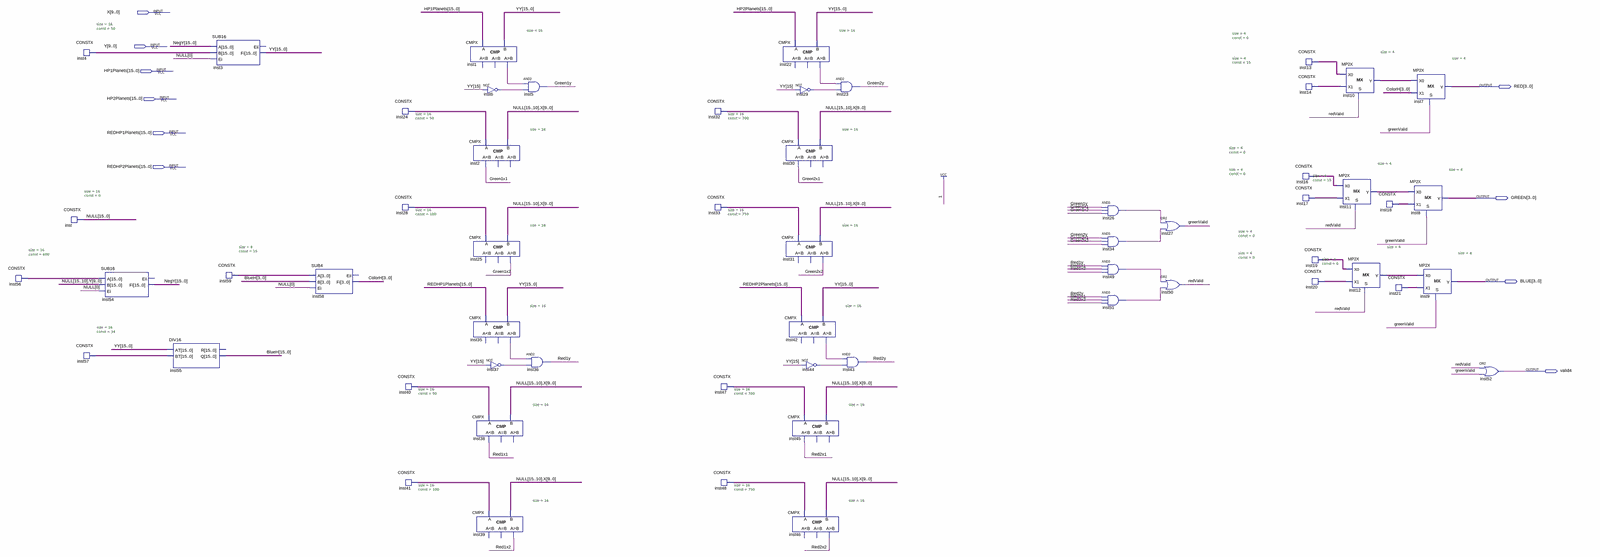
[diagram p0: schematic sheet, whole]
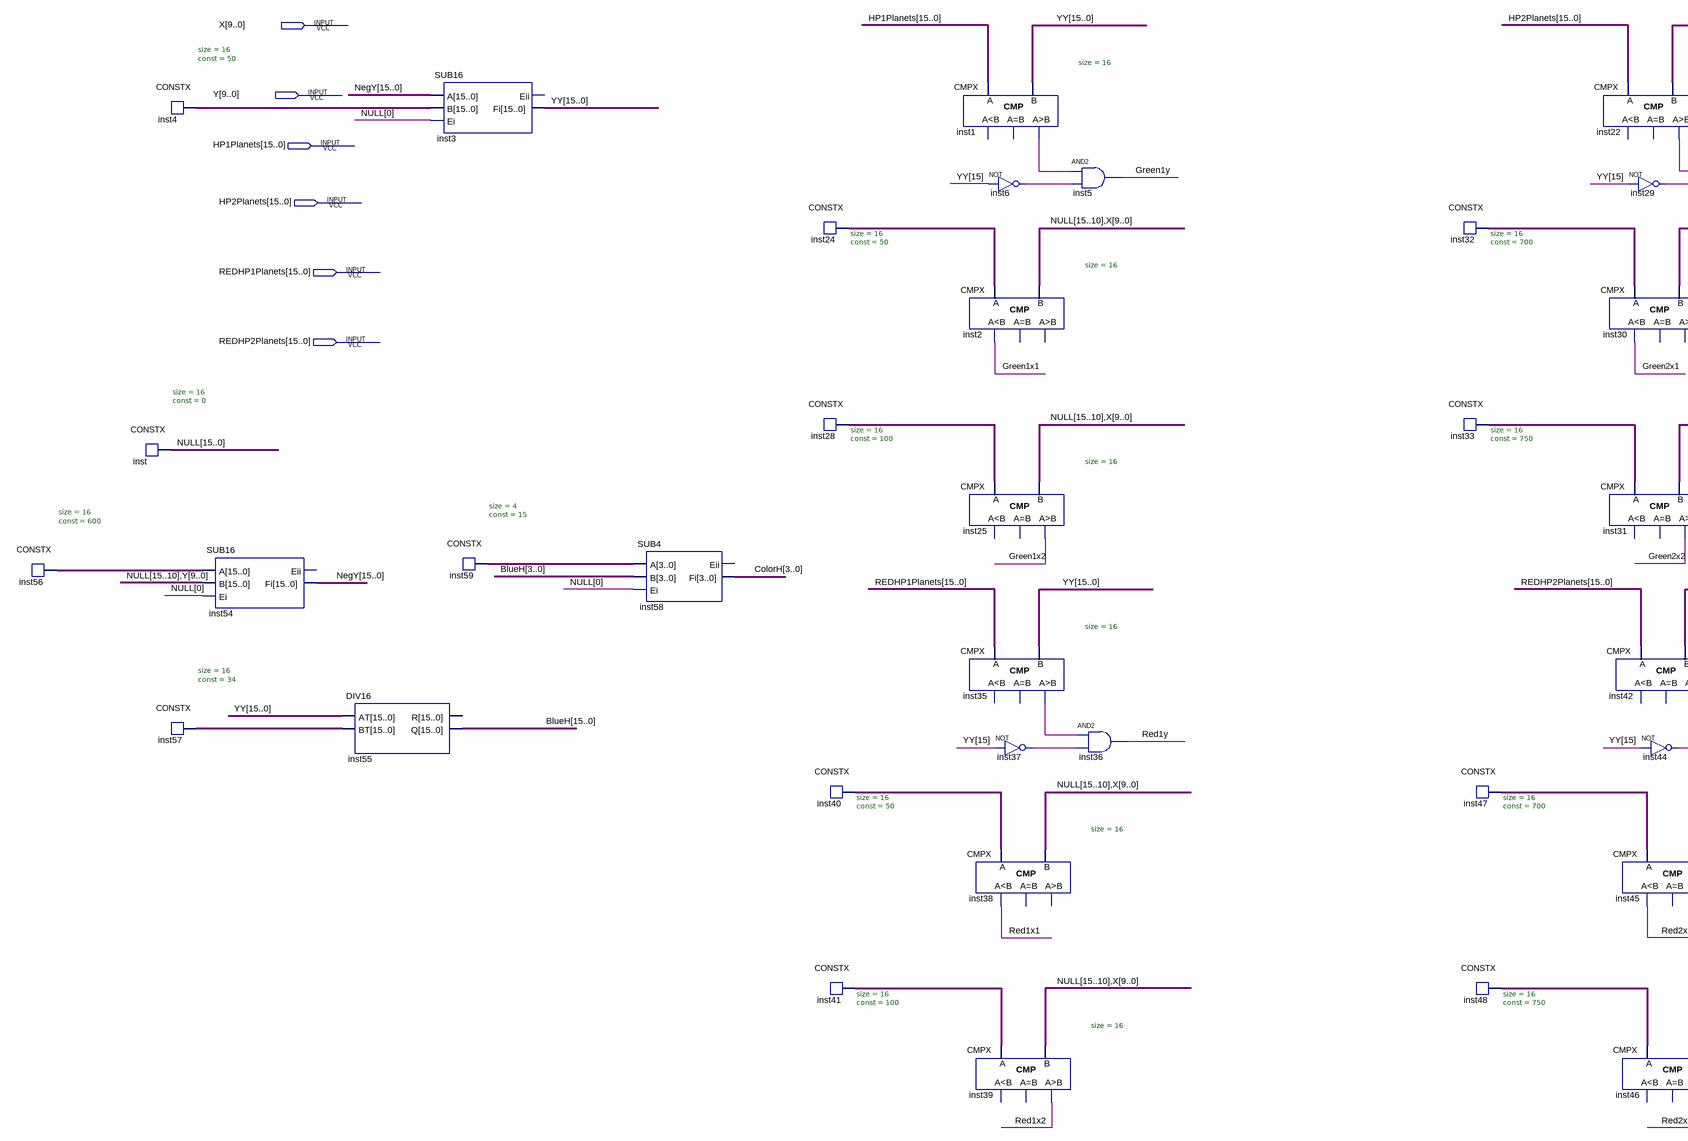
[diagram p1: schematic sheet, left part]
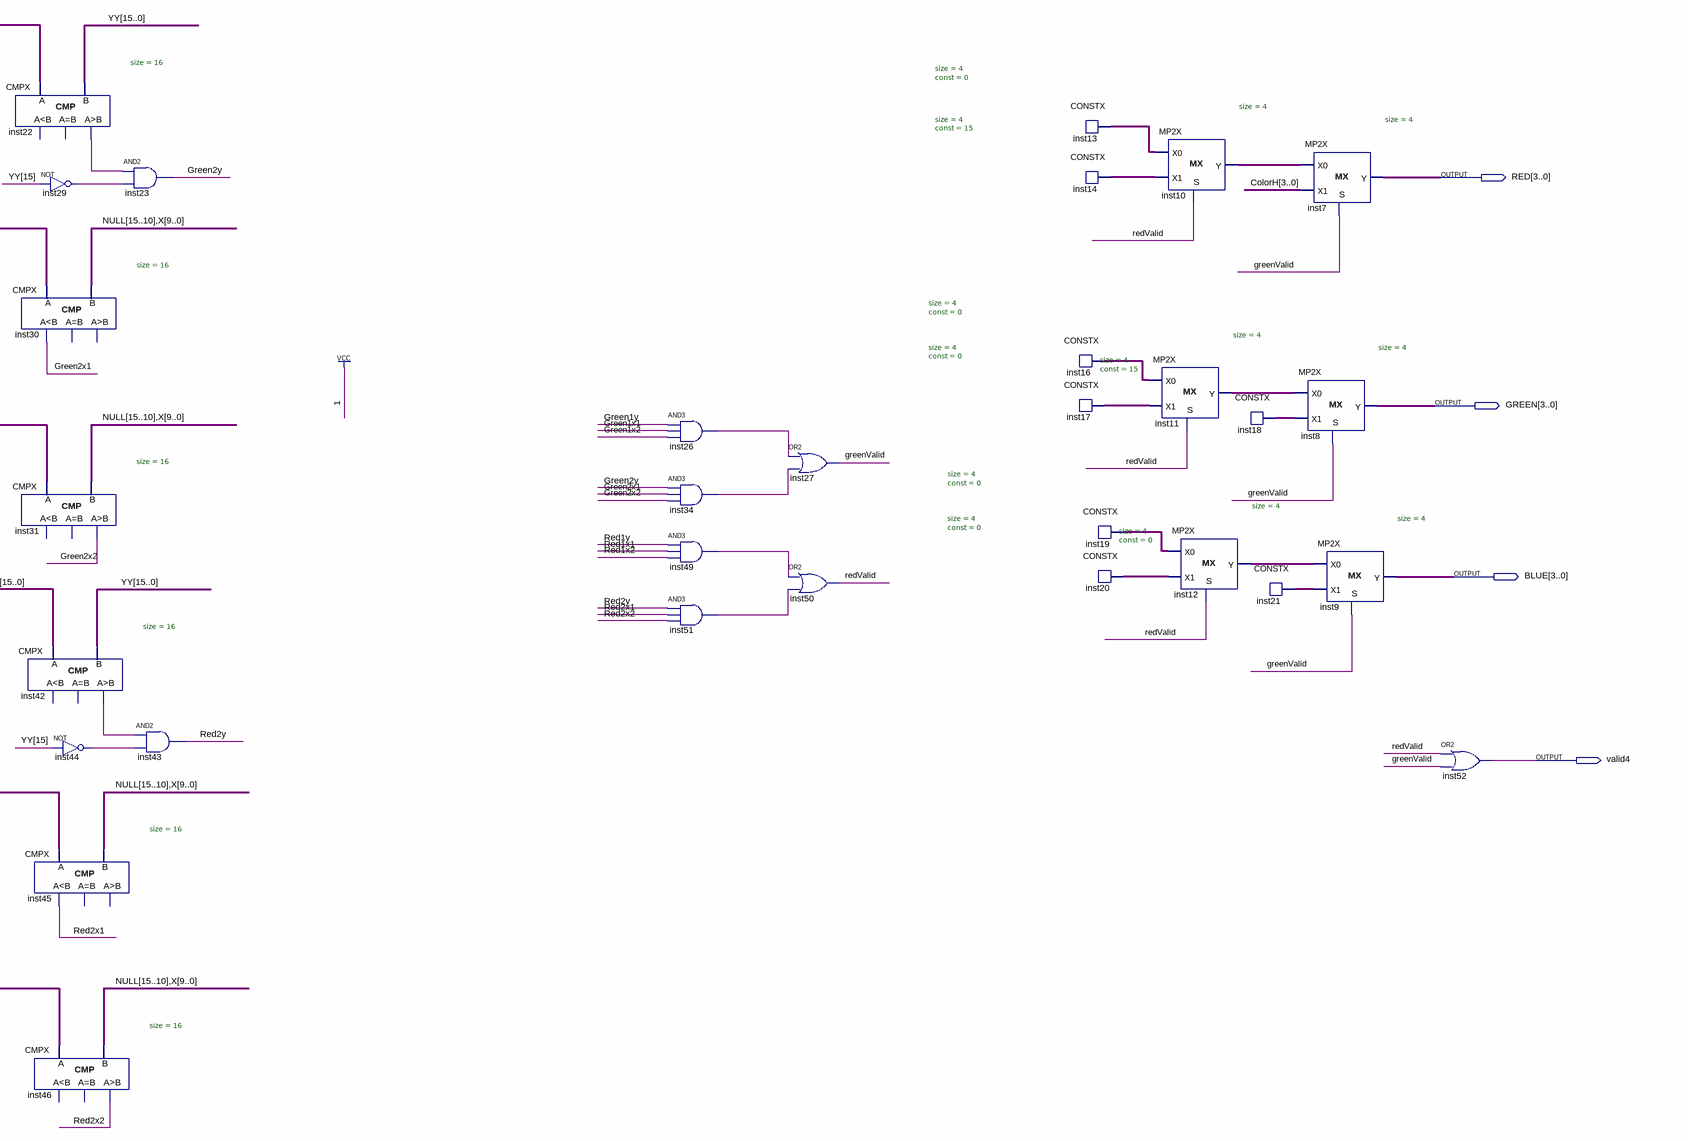
[diagram p2: schematic sheet, right part]
// Quartus schematic heltsDraw.bdf as structural Verilog: 58 symbols, 10 pins
module heltsDraw (
  input  [9:0] X,
  input  [9:0] Y,
  input  [15:0] HP1Planets,
  input  [15:0] HP2Planets,
  input  [15:0] REDHP1Planets,
  input  [15:0] REDHP2Planets,
  output [3:0] RED,
  output [3:0] GREEN,
  output [3:0] BLUE,
  output valid4
);

  wire Green1x1, Green1x2, Green1y, Green2x1, Green2x2, Green2y, greenValid, inst1_gr, inst6_out, inst22_gr,
       inst26_out, inst29_out, inst34_out, inst35_gr, inst37_out, inst42_gr, inst44_out, inst49_out,
       inst51_out, Red1x1, Red1x2, Red1y, Red2x1, Red2x2, Red2y, redValid;
  wire [3:0] ColorH, inst10_y, inst11_y, inst12_y, inst13_data, inst14_data, inst16_data, inst17_data,
       inst18_data, inst19_data, inst20_data, inst21_data, inst59_data;
  wire [15:0] BlueH, inst4_data, inst24_data, inst28_data, inst32_data, inst33_data, inst40_data,
       inst41_data, inst47_data, inst48_data, inst56_data, inst57_data, NegY, NULL, YY;

  CONSTX #(.size(16), .\const (600)) inst56 (.data(inst56_data));
  CONSTX #(.size(16), .\const (50)) inst4 (.data(inst4_data));
  CONSTX #(.size(16), .\const (0)) inst (.data(NULL));
  CONSTX #(.size(16), .\const (34)) inst57 (.data(inst57_data));
  SUB16 inst54 (.A(inst56_data), .B({NULL[15:10], Y}), .Ei(NULL[0]), .Fi(NegY));  // open: Eii
  DIV16 inst55 (.AT(YY), .BT(inst57_data), .Q(BlueH));  // open: R
  SUB16 inst3 (.A(NegY), .B(inst4_data), .Ei(NULL[0]), .Fi(YY));  // open: Eii
  CONSTX #(.size(4), .\const (15)) inst59 (.data(inst59_data));
  SUB4 inst58 (.A(inst59_data), .B(BlueH[3:0]), .Ei(NULL[0]), .Fi(ColorH));  // open: Eii
  CONSTX #(.size(16), .\const (50)) inst24 (.data(inst24_data));
  CONSTX #(.size(16), .\const (100)) inst28 (.data(inst28_data));
  CONSTX #(.size(16), .\const (50)) inst40 (.data(inst40_data));
  CONSTX #(.size(16), .\const (100)) inst41 (.data(inst41_data));
  CMPX #(.size(16)) inst1 (.A(HP1Planets), .B(YY), .gr(inst1_gr));  // open: ls, eq
  CMPX #(.size(16)) inst2 (.A(inst24_data), .B({NULL[15:10], X}), .ls(Green1x1));  // open: eq, gr
  CMPX #(.size(16)) inst25 (.A(inst28_data), .B({NULL[15:10], X}), .gr(Green1x2));  // open: ls, eq
  CMPX #(.size(16)) inst35 (.A(REDHP1Planets), .B(YY), .gr(inst35_gr));  // open: ls, eq
  CMPX #(.size(16)) inst38 (.A(inst40_data), .B({NULL[15:10], X}), .ls(Red1x1));  // open: eq, gr
  CMPX #(.size(16)) inst39 (.A(inst41_data), .B({NULL[15:10], X}), .gr(Red1x2));  // open: ls, eq
  not inst6 (inst6_out, YY[15]);
  not inst37 (inst37_out, YY[15]);
  and inst5 (Green1y, inst1_gr, inst6_out);
  and inst36 (Red1y, inst35_gr, inst37_out);
  CONSTX #(.size(16), .\const (700)) inst32 (.data(inst32_data));
  CONSTX #(.size(16), .\const (750)) inst33 (.data(inst33_data));
  CONSTX #(.size(16), .\const (700)) inst47 (.data(inst47_data));
  CONSTX #(.size(16), .\const (750)) inst48 (.data(inst48_data));
  CMPX #(.size(16)) inst22 (.A(HP2Planets), .B(YY), .gr(inst22_gr));  // open: ls, eq
  not inst29 (inst29_out, YY[15]);
  CMPX #(.size(16)) inst30 (.A(inst32_data), .B({NULL[15:10], X}), .ls(Green2x1));  // open: eq, gr
  CMPX #(.size(16)) inst31 (.A(inst33_data), .B({NULL[15:10], X}), .gr(Green2x2));  // open: ls, eq
  CMPX #(.size(16)) inst42 (.A(REDHP2Planets), .B(YY), .gr(inst42_gr));  // open: ls, eq
  not inst44 (inst44_out, YY[15]);
  CMPX #(.size(16)) inst45 (.A(inst47_data), .B({NULL[15:10], X}), .ls(Red2x1));  // open: eq, gr
  CMPX #(.size(16)) inst46 (.A(inst48_data), .B({NULL[15:10], X}), .gr(Red2x2));  // open: ls, eq
  and inst23 (Green2y, inst22_gr, inst29_out);
  and inst43 (Red2y, inst42_gr, inst44_out);
  and inst26 (inst26_out, Green1y, Green1x1, Green1x2);
  and inst34 (inst34_out, Green2y, Green2x1, Green2x2);
  and inst49 (inst49_out, Red1y, Red1x1, Red1x2);
  and inst51 (inst51_out, Red2y, Red2x1, Red2x2);
  or inst27 (greenValid, inst26_out, inst34_out);
  or inst50 (redValid, inst49_out, inst51_out);
  CONSTX #(.size(4), .\const (0)) inst13 (.data(inst13_data));
  CONSTX #(.size(4), .\const (15)) inst14 (.data(inst14_data));
  CONSTX #(.size(4), .\const (0)) inst16 (.data(inst16_data));
  CONSTX #(.size(4), .\const (0)) inst17 (.data(inst17_data));
  CONSTX #(.size(4), .\const (0)) inst19 (.data(inst19_data));
  CONSTX #(.size(4), .\const (0)) inst20 (.data(inst20_data));
  MP2X #(.size(4)) inst10 (.S(redValid), .X0(inst13_data), .X1(inst14_data), .Y(inst10_y));
  MP2X #(.size(4)) inst11 (.S(redValid), .X0(inst16_data), .X1(inst17_data), .Y(inst11_y));
  MP2X #(.size(4)) inst12 (.S(redValid), .X0(inst19_data), .X1(inst20_data), .Y(inst12_y));
  CONSTX #(.size(4), .\const (15)) inst18 (.data(inst18_data));
  CONSTX #(.size(4), .\const (0)) inst21 (.data(inst21_data));
  MP2X #(.size(4)) inst7 (.S(greenValid), .X0(inst10_y), .X1(ColorH), .Y(RED));
  MP2X #(.size(4)) inst8 (.S(greenValid), .X0(inst11_y), .X1(inst18_data), .Y(GREEN));
  MP2X #(.size(4)) inst9 (.S(greenValid), .X0(inst12_y), .X1(inst21_data), .Y(BLUE));
  or inst52 (valid4, redValid, greenValid);
endmodule
